# EAGLE design Adafruit FTDI Friend Rev B (EAGLE 9.6.2)
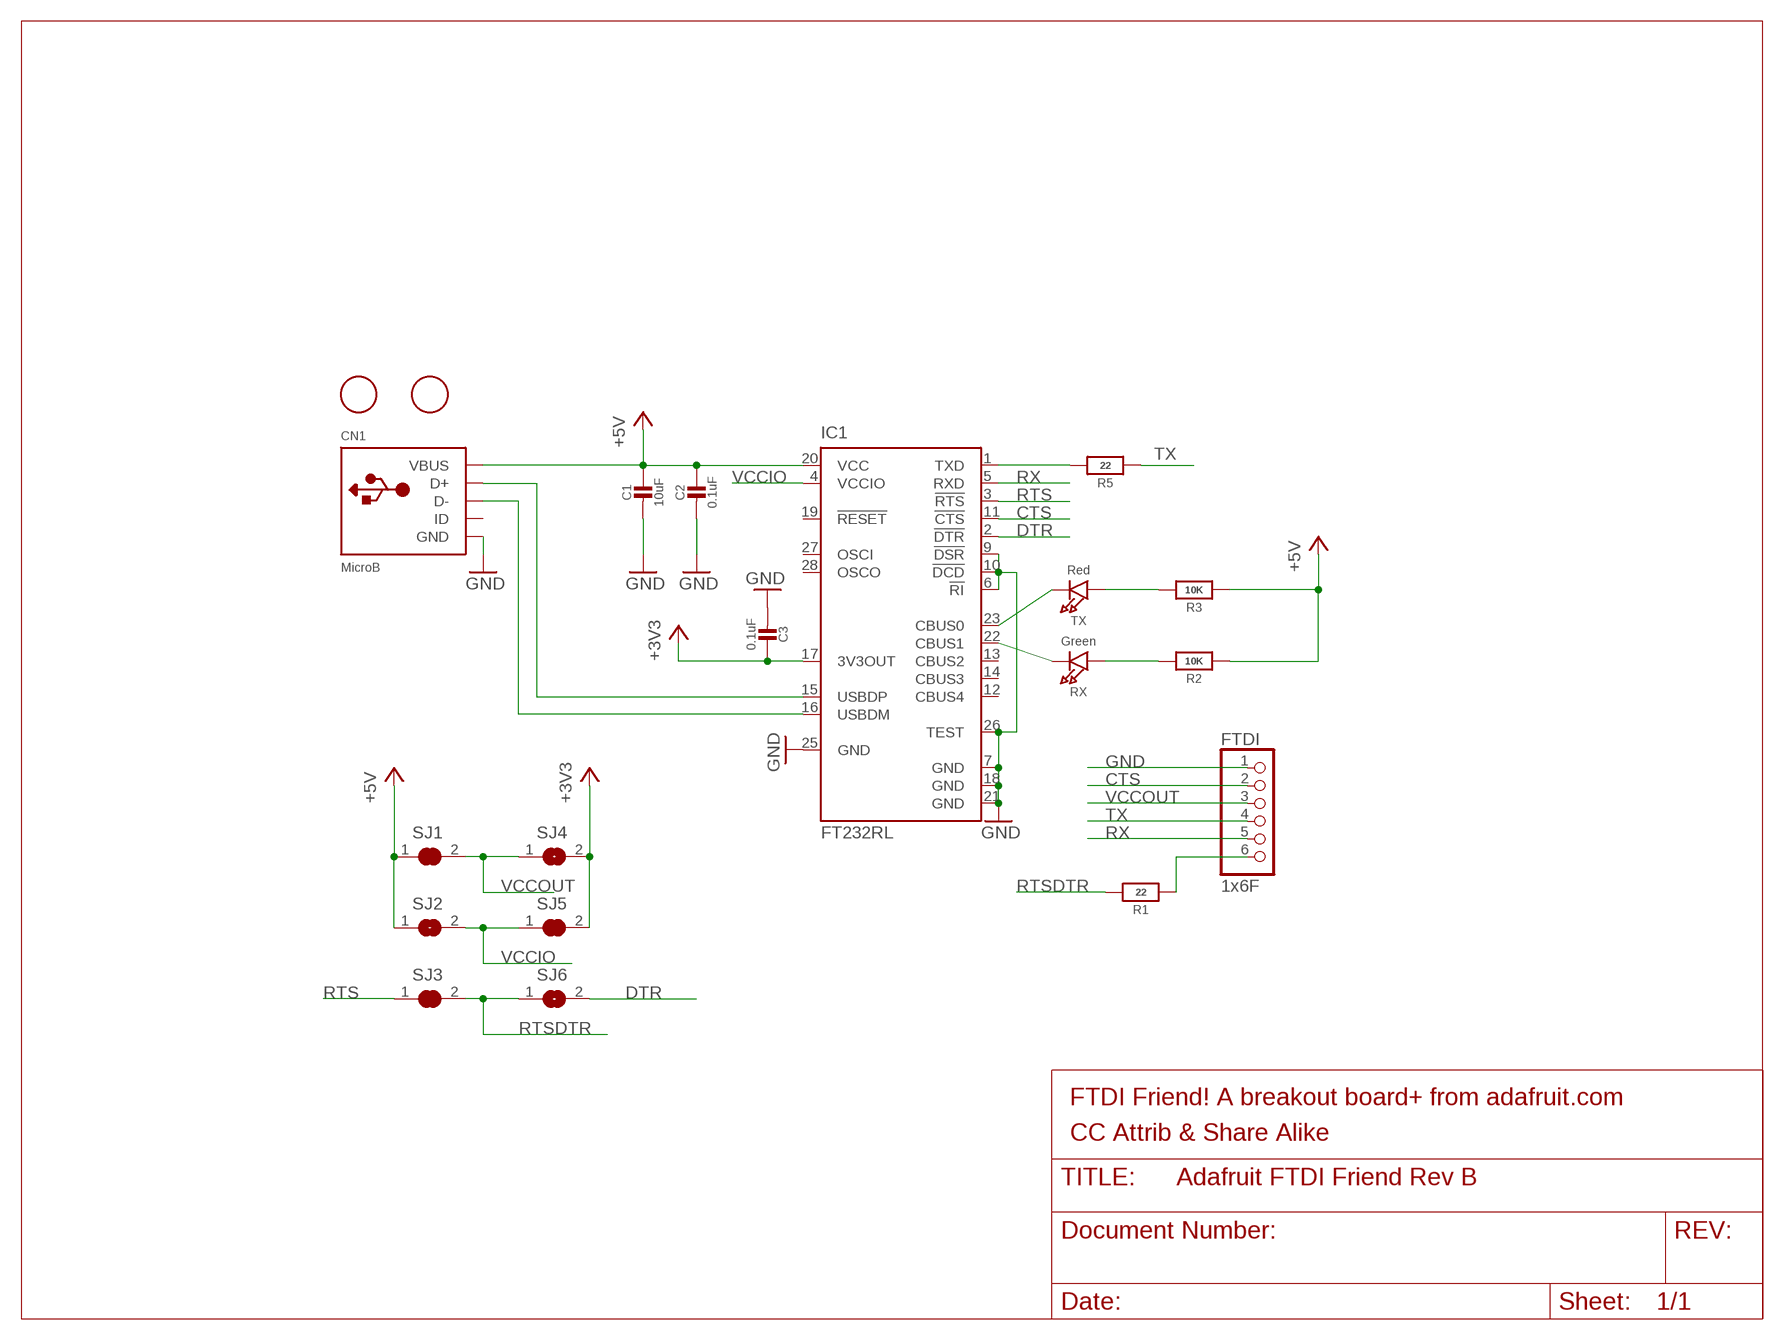
[diagram p0: schematic, sheet 1]

## Parts
C1  10uF  CAP_CERAMIC0805-NOOUTLINE  [0805-NO]
C2  0.1uF  CAP_CERAMIC0603_NO  [0603-NO]
C3  0.1uF  CAP_CERAMIC0603_NO  [0603-NO]
CN1  MicroB  USB_MICROXNJ073  [SHOU_MICROXNJ073]
FTDI  1x6F  PINHD-1X6CB  [1X06-CLEANBIG]
IC1  FT232RL  [SSOP28]
R1  22  RESISTOR_0603_NOOUT  [0603-NO]
R2  10K  RESISTOR_0603_NOOUT  [0603-NO]
R3  10K  RESISTOR_0603_NOOUT  [0603-NO]
R5  22  RESISTOR_0603_NOOUT  [0603-NO]
RX  Green  LED0603_NOOUTLINE  [CHIPLED_0603_NOOUTLINE]
SJ1  SOLDERJUMPER_CLOSED  [SOLDERJUMPER_CLOSEDWIRE]
SJ2  SOLDERJUMPER  [SOLDERJUMPER_ARROW_NOPASTE]
SJ3  SOLDERJUMPER_CLOSED  [SOLDERJUMPER_CLOSEDWIRE]
SJ4  SOLDERJUMPER  [SOLDERJUMPER_ARROW_NOPASTE]
SJ5  SOLDERJUMPER_CLOSED  [SOLDERJUMPER_CLOSEDWIRE]
SJ6  SOLDERJUMPER  [SOLDERJUMPER_ARROW_NOPASTE]
TX  Red  LED0603_NOOUTLINE  [CHIPLED_0603_NOOUTLINE]
U$1  FIDUCIAL  [FIDUCIAL_1MM]
U$2  FIDUCIAL  [FIDUCIAL_1MM]

## Nets
+3V3: C3.1 IC1.17(3V3OUT) SJ4.2 SJ5.2
+5V: C1.1 C2.1 CN1.VBUS IC1.20(VCC) R2.1 R3.1 SJ1.1 SJ2.1
CTS: FTDI.2 IC1.11(!CTS)
DTR: IC1.2(!DTR) SJ6.2
GND: C1.2 C2.2 C3.2 CN1.BASE@1(GND) CN1.BASE@2(GND) CN1.GND CN1.SPRT@1(GND) CN1.SPRT@2(GND) CN1.SPRT@3(GND) CN1.SPRT@4(GND) FTDI.1 IC1.6(!RI) IC1.7(GND) IC1.9(!DSR) IC1.10(!DCD) IC1.18(GND) IC1.21(GND) IC1.25(GND) IC1.26(TEST)
N$2: FTDI.6 R1.1
N$3: CN1.D+ IC1.15(USBDP)
N$4: CN1.D- IC1.16(USBDM)
N$5: IC1.1(TXD) R5.2
N$6: IC1.23(CBUS0) TX.C
N$7: IC1.22(CBUS1) RX.C
N$8: R2.2 RX.A
N$9: R3.2 TX.A
RTS: IC1.3(!RTS) SJ3.1
RTSDTR: R1.2 SJ3.2 SJ6.1
RX: FTDI.5 IC1.5(RXD)
TX: FTDI.4 R5.1
VCCIO: IC1.4(VCCIO) SJ2.2 SJ5.1
VCCOUT: FTDI.3 SJ1.2 SJ4.1
Unconnected: CN1.ID IC1.12(CBUS4) IC1.13(CBUS2) IC1.14(CBUS3) IC1.19(!RESET) IC1.27(OSCI) IC1.28(OSCO)

## Notes on the sheet
- FTDI Friend! A breakout board+ from adafruit.com
- CC Attrib & Share Alike

## Library data of the parts
C1-C3 = microbuilder:CAP_CERAMIC: Ceramic Capacitors For new designs, use the packages preceded by an '_' character since they are more reliable: The following footprints should be used on most boards: _0402 - Standard footprint for regular board layouts _0603 - Standard footprint for regular board layouts _0805 - Standard footprint for regular board layouts _1206 - Standard footprint for regular board layouts For extremely tight-pitch boards where space is at a premium, the following 'micro-pitch' footprints can be used (smaller pads, no silkscreen outline, etc.): _0402MP - Micro-pitch footprint for very dense/compact boards _0603MP - Micro-pitch footprint for very dense/compact boards _0805MP - Micro-pitch footprint for very dense/compact boards _1206MP - Micro-pitch footprint for very dense/compact boards
CN1 = adafruit_electromech:USB: USB Connectors USBMINIB - Surface Mount Female Mini-B USB Connector 4UConnector: 06564; LCSC: C404969
FTDI = adafruit:PINHD-1X6: PIN HEADER
IC1 = ftdichip:FT232R: Source: http://www.ftdichip.com/Documents/DataSheets/DS_FT232R_v104.pdf; MPN: FT232RL; OC_FARNELL: 1146032; OC_NEWARK: 91K9918
R1-R3 R5 = microbuilder:RESISTOR: Resistors For new designs, use the packages preceded by an '_' character since they are more reliable: The following footprints should be used on most boards: _0402 - Standard footprint for regular board layouts _0603 - Standard footprint for regular board layouts _0805 - Standard footprint for regular board layouts _1206 - Standard footprint for regular board layouts For extremely tight-pitch boards where space is at a premium, the following 'micro-pitch' footprints can be used (smaller pads, no silkscreen outline, etc.): _0402MP - Micro-pitch footprint for very dense/compact boards _0603MP - Micro-pitch footprint for very dense/compact boards _0805MP - Micro-pitch footprint for very dense/compact boards _1206MP - Micro-pitch footprint for very dense/compact boards
RX TX = microbuilder:LED: LED 0603 - 0603 Surface Mount Package 2mA: Green LED - Low Power (3.9mcd, 2ma, 1.7Vf) - Digikey: 475-2709-2-ND Orange LED - Low Power (9.8mcd, 2ma, 1.8Vf) - Digikey: 475-1194-2-ND Red LED - Low Power (5mcd, 2ma, 1.8Vf) - Digikey: 475-1195-2-ND Yellow LED - Low Power (7mcd, 2ma, 1.8Vf) - Digikey: 475-1196-2-ND 5mA: Blue LED - Low Power (17mcd, 5ma, 2.9Vf) - Digikey: LNJ937W8CRACT-ND 0805 - 0805 Surface Mount Package 2mA: Red LED (8.8mcd, 2mA, 1.8Vf, Clear) - Low Power [Digikey: 475-2510-1-ND] Green LED (5mcd, 2mA, 1.8Vf, Clear) - Low Power [Digikey: 475-2730-1-ND] Yellow LED (11.3mcd, 2mA, 1.8Vf, Clear) - Low Power [Digikey: 475-2555-1-ND] 20mA: Red LED (104mcd, 20mA, Diffused) - LS R976 [Digikey: 475-1278-6-ND] Red LED (12mcd, 20mA, 2.0Vf, Clear) - APT2012EC [Digikey: 754-1128-1-ND] Green LED (15mcd, 20mA, 2.2Vf, Clear) - APT2012GC [Digikey: 754-1131-1-ND] Orange LED (160mcd, 20mA, 2.1Vf, Clear) - APT2012SECK [Digikey: 754-1130-1-ND] 1206 - 1206 Surface Mount Package Green LED (26mcd, 20mA, Diffused) - LG N971 [Digikey: 475-1407-6-ND] Red LED (15mcd, 20mA, Diffused) - LH N974 [Digikey: 475-1416-6-ND] Cree - Cree High-Power Surface Mount LEDs XPEBWT-L1-0000-00D50 - White 111lm 350mA 2.9Vf 6200K 110° XTEAWT-00-0000-00000LEE3 - White 114lm 350mA 2.85Vf 5000K 115° Everlight - Everlight 45-21 Series Surface Mount LEDs 45-21/QK2C-B2832AC2CB2/2T - Warm White 2000mcd 20mA 3.25Vf 3050K 120° 45-21/LK2C-B38452C4CB2/2T - Nuetral White 2000mcd 20mA 3.25Vf 4150K 120° 45-21/LK2C-B50634C6CB2/2T - Cold White 2200mcd 20mA 3.25Vf 5650K 120° PLCC2 Reverse Mount LS T77K-J1L2-1-0-2-R18-Z - Red 11.25mcd 2mA 1.8Vf 630nm 120° LO T77K-L1M2-24-Z - Orange 19.6mcd 2mA 1.8Vf 606nm 120° LY T77K-K2M1-26-Z - Yellow 15.7mcd 2mA 1.8Vf 587nm 120°; ROT: 270
SJ1 SJ3 SJ5 = microbuilder:SOLDERJUMPER_CLOSED: Solder Jumper - Closed These solder jumpers are closed by default CLOSEDWIRE - 10 mil trace between pads that can be cut and resoldered later CLOSEDPERM - 63 mil trace between pads for a permanent connection (used to 'bridge' two signals, a shameless hack for Eagle). Can double as a test point as well (no cream layer)
SJ2 SJ4 SJ6 = microbuilder:SOLDERJUMPER: SMD Solder JUMPER Solder the two pads together to create a connection, or remove the solder to break it. REFLOW - Use this footprint for solder paste and reflow ovens. WAVE - Use this footprint for hand-soldering (larger pads). CLOSED - Has a trace between the two pads to ensure it is closed by default. The trace needs to be cut to disable the jumper, and can be closed again by creating a solder bridge between the two pads.; BOM: EXCLUDE
U$1 U$2 = adafruit:FIDUCIAL: For use by pick and place machines to calibrate the vision/machine, 1mm By microbuilder.eu

## Board
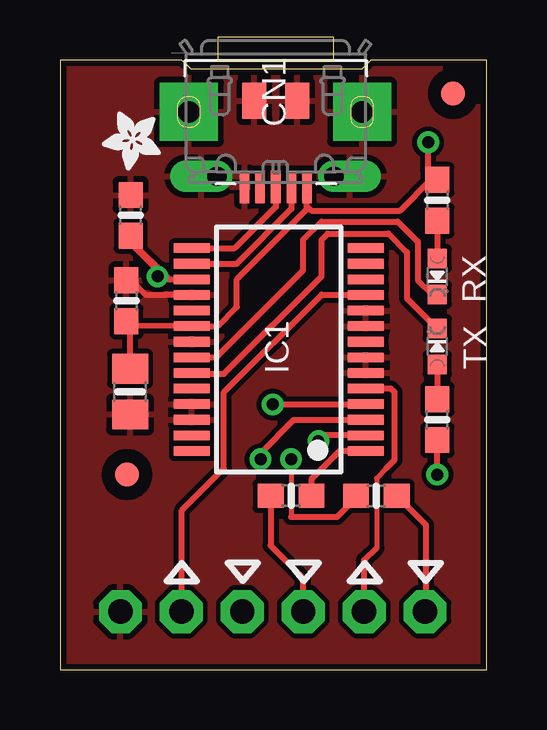
[diagram p1: board, top side]
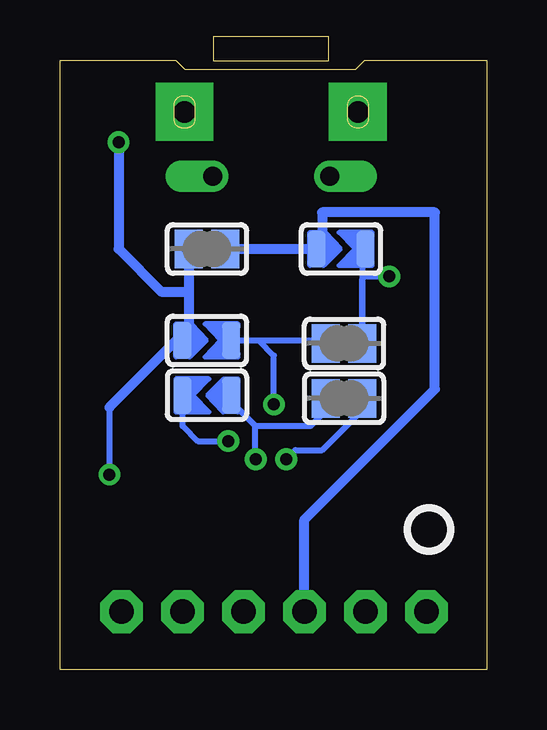
[diagram p2: board, bottom side, seen from below]

Size 17.78 x 25.4 mm. Coordinates in mm from the lower left corner, seen from the top.
Outline: 0,25.4 0,0 17.78,0 17.78,25.4 12.95,25.4 12.57,25.02 5.46,25.02 5.08,25.4 0,25.4
Copper layers (1*16): Top 0.035mm / dielectric 1.5mm / Bottom 0.035mm
Design rules "adafruit 8-8": minimum track width 6mil, minimum drill 15.5mil, track to track 8mil, track to pad 8mil, pad to pad 8mil, via to via 8mil, smd to smd 8mil, copper to edge 10mil, drill to drill 8mil, minimum pad ring 10mil, minimum via ring 8mil, stop-mask expansion 2mil, vias tented up to drill 20mil, thermal gap 10mil

### Footprints (pad centres in the part's own frame; a part is rotated, then mirrored left to right if it is on the bottom)
0805-NO = smd 1.24 x 1.5: 1 -0.95,0; 2 0.95,0
0603-NO = smd 1.075 x 1: 1 -0.85,0; 2 0.85,0
SHOU_MICROXNJ073 = smd 1 x 1.5: BASE@1 -0.889,-1.721; BASE@2 0.889,-1.721 | smd 0.4 x 1.35: D+ 0,1.86; D- -0.65,1.86; GND 1.3,1.86; ID 0.65,1.86; VBUS -1.3,1.86 | drill 0.8 pad 1.143 offset: SPRT@1 -2.425,1.41; SPRT@2 2.45,1.41 | drill 0.9 pad 2.413 square: SPRT@3 -3.6,-1.265; SPRT@4 3.625,-1.265
1X06-CLEANBIG = drill 1.016 pad 1.778 octagon: 1 -6.35,0; 2 -3.81,0; 3 -1.27,0; 4 1.27,0; 5 3.81,0; 6 6.35,0
SSOP28 = smd 0.4 x 1.5: 1 -4.225,-3.625; 2 -3.575,-3.625; 3 -2.925,-3.625; 4 -2.275,-3.625; 5 -1.625,-3.625; 6 -0.975,-3.625; 7 -0.325,-3.625; 8 0.325,-3.625; 9 0.975,-3.625; 10 1.625,-3.625; 11 2.275,-3.625; 12 2.925,-3.625; 13 3.575,-3.625; 14 4.225,-3.625; 15 4.225,3.625; 16 3.575,3.625; 17 2.925,3.625; 18 2.275,3.625; 19 1.625,3.625; 20 0.975,3.625; 21 0.325,3.625; 22 -0.325,3.625; 23 -0.975,3.625; 24 -1.625,3.625; 25 -2.275,3.625; 26 -2.925,3.625; 27 -3.575,3.625; 28 -4.225,3.625
CHIPLED_0603_NOOUTLINE = smd 0.8 x 0.8: A 0,-0.75; C 0,0.75
SOLDERJUMPER_CLOSEDWIRE = smd 1.168 x 1.6: 1 -0.762,0; 2 0.762,0 | smd 0.635 x 0.203: WIRE 0,0
SOLDERJUMPER_ARROW_NOPASTE = smd 0.762 x 1.524: 1 -1.016,0; 2 1.016,0
FIDUCIAL_1MM = smd 1 x 1: 1 0,0

### Placement (x,y rotation side)
C1  2.92,11.58 270 top
C2  2.77,15.37 90 top
C3  2.95,18.92 90 top
CN1  8.99,21.97 180 top
FTDI  8.86,2.41 0 top
IC1  9.12,13.34 90 top
PLABEL0  [PLABEL0]  10.57,4.7 90 top
PLABEL1  [PLABEL1]  13.11,4.57 90 top
PLABEL2  [PLABEL2]  8.03,4.83 90 top
PLABEL3  [PLABEL3]  15.77,4.57 90 top
PLABEL4  [PLABEL4]  5.61,4.83 90 top
PLABEL5  [PLABEL5]  3.07,3.56 90 top
PLABEL6  [PLABEL6]  1.27,1.4 90 top
PLABEL7  [PLABEL7]  17.53,1.27 90 top
PLABEL8  [PLABEL8]  1.52,7.24 90 top
PLABEL9  [PLABEL9]  17.42,12.57 90 top
PLABEL10  [PLABEL10]  17.42,15.37 90 top
PLABEL11  [PLABEL11]  8.76,19.3 0 bottom
PLABEL12  [PLABEL12]  8.51,15.75 0 bottom
PLABEL13  [PLABEL13]  8.76,9.65 0 bottom
PLABEL14  [PLABEL14]  14.73,13.72 0 bottom
PLABEL15  [PLABEL15]  14.86,17.53 0 bottom
PLABEL16  [PLABEL16]  2.92,13.59 0 bottom
PLABEL17  [PLABEL17]  2.92,17.65 0 bottom
PLABEL18  [PLABEL18]  2.79,11.3 0 bottom
PLABEL19  [PLABEL19]  14.86,11.43 0 bottom
PLABEL20  [PLABEL20]  8.76,13.84 0 bottom
PLABEL21  [PLABEL21]  8.76,17.65 0 bottom
PLABEL22  [PLABEL22]  8.76,11.43 0 bottom
PLABEL23  [PLABEL23]  9.27,7.11 0 bottom
PLABEL24  [PLABEL24]  8.89,4.95 0 bottom
R1  13.18,7.24 180 top
R2  15.72,19.56 270 top
R3  15.72,10.41 90 top
R5  9.63,7.24 0 top
RX  15.72,16.38 180 top
SJ1  11.66,17.53 0 bottom
SJ2  11.66,13.72 0 bottom
SJ3  5.94,11.3 180 bottom
SJ4  6.07,17.53 0 bottom
SJ5  5.94,13.59 0 bottom
SJ6  11.66,11.43 180 bottom
TX  15.72,13.46 0 top
U$1  16.38,24 270 top
U$2  2.79,8.13 270 top
U$3  [PCBFEAT-REV-040]  2.41,5.84 0 bottom
U$4  [ADAFRUIT_2.5MM]  4.19,23.24 180 top

### Tracks (layer width: path | path; a pad name or v marks a point on that pad's centre or on a via)
+3V3  (via drill 0.5)
  Top 0.254: IC1.17 4.54,16.26 2.95,17.86 C3.1 2.95,17.75 4.06,16.64 v4.06,16.38
  Bottom 0.254: SJ4.2 5.18,17.4 SJ5.2 5.18,16.28 5.08,16.38 v4.06,16.38
+5V  (via drill 0.5)
  Top 0.254: 10.29,19.3 10.29,19.18 7.37,16.26 7.37,15.11 7.34,15.11 7.34,15.09 6.56,14.31 IC1.20 3.15,14.34 3.05,14.24 C2.1 2.77,14.33 2.92,14.48 C1.1 | 10.29,19.3 CN1.VBUS | v15.72,8.13 R3.1 | 10.29,19.3 10.47,19.13 14.17,19.13 15.46,20.41 R2.1 15.34,20.79 v15.34,21.97
  Bottom 0.254: 15.72,10.92 v15.72,8.13
  Bottom 0.406: v15.34,21.97 15.34,17.53 13.56,15.75 12.42,15.75 | SJ1.1 12.42,15.75 | 12.42,15.75 12.42,13.97 SJ2.1 12.93,13.72 15.72,10.92
CTS
  Top 0.254: IC1.11 12.18,15.61 12.17,15.62 10.9,15.62 6.83,11.56 6.83,8.38 5.08,6.63 5.08,2.44 FTDI.2
DTR  (via drill 0.5)
  Top 0.254: IC1.2 11.01,9.76 v10.77,9.53
  Bottom 0.254: v10.77,9.53 12.04,9.53 12.68,10.16 SJ6.2
GND
  Top 0.254: IC1.18 4.4,15.61 4.39,15.6 3.58,15.6 2.96,16.22 C2.2
  pour Top: 17.78,25.4 0,25.4 0,0 17.78,0
N$2
  Top 0.254: FTDI.6 15.24,2.44 15.24,6.03 R1.1
N$3
  Top 0.254: CN1.D+ 8.99,19.28 7.27,17.56 IC1.15
N$4
  Top 0.254: IC1.16 7.36,16.91 9.64,19.19 CN1.D-
N$5
  Top 0.254: IC1.1 11.65,9.11 10.47,7.93 R5.2
N$6
  Top 0.254: IC1.23 5.01,12.36 5.05,12.32 6.83,12.32 10.9,16.38 10.9,17.91 11.15,18.16 13.69,18.16 14.45,17.4 14.45,15.48 TX.C
N$7
  Top 0.254: IC1.22 6.53,13.01 6.6,13.08 6.58,13.08 10.13,16.64 10.13,17.91 10.9,18.67 14.07,18.67 14.91,17.83 14.91,16.2 15.48,15.63 RX.C
N$8
  Top 0.254: RX.A 15.72,17.27 15.72,17.3 R2.2
N$9
  Top 0.254: TX.A R3.2
RTS  (via drill 0.5)
  Top 0.254: IC1.3 9.75,10.41 8.36,9.02 v8.36,8.76
  Bottom 0.254: v8.36,8.76 7.98,9.14 6.86,9.14 5.21,10.79 5.21,11.3 SJ3.1
RTSDTR  (via drill 0.5)
  Top 0.203: 9.63,8.38 9.63,6.35
  Top 0.254: R1.2 12.33,7.14 11.54,6.35 9.63,6.35 | v9.63,8.76 9.63,8.38
  Bottom 0.254: SJ6.1 10.54,11.79 10.54,11.05 9.65,10.16 | SJ3.2 6.71,10.79 7.34,10.16 9.65,10.16 | v9.63,8.76 9.65,8.76 9.65,10.16
RX
  Top 0.203: 13.19,5.06 13.19,7.98 13.59,8.38
  Top 0.254: FTDI.5 12.68,4.57 12.7,4.57 13.19,5.06 | IC1.5 13.79,11.71 13.95,11.56 13.95,8.74 13.59,8.38
TX
  Top 0.254: R5.1 8.78,5.17 10.13,3.81 FTDI.4
VCCIO  (via drill 0.5)
  Top 0.254: IC1.4 8.88,11.06 v8.87,11.05
  Bottom 0.254: SJ2.2 9.5,13.72 | 9.5,13.72 6.83,13.72 SJ5.1 | 9.5,13.72 8.87,13.08 v8.87,11.05
VCCOUT
  Bottom 0.254: 6.86,17.91 6.58,17.91 6.58,17.7 SJ4.1
  Bottom 0.406: SJ1.2 SJ4.1 | FTDI.3 7.59,6.25 2.16,11.68 2.16,19.05 6.86,19.05 6.86,17.91

### Text on the board
Pinguin_tBackup: RX | TX | FTDI Friend! by Adafruit | CTS | VCC | TX | RX | RTS | GND | BLACK | GREEN
Pinguin_bBackup: VCC out | +3V | OR | +5V | Signal logic level | +3V | OR | +5V | RTS | OR | DTR | Pin 6 signal | FTDI Friend | from adafruit!